# Altium schematic sheet Battery.SCHDOC
size A4
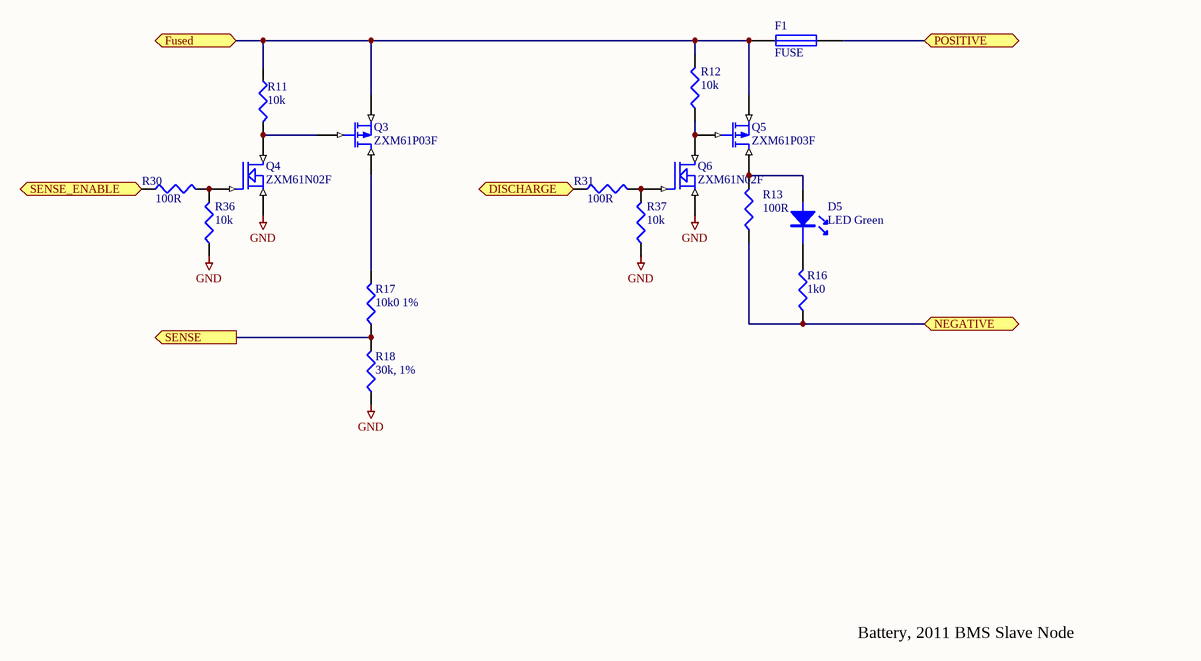
[diagram p0: Battery.SCHDOC]

## Parts
D5  LED Green  [0603_LED]
F1  FUSE  [LITTELFUSE-154]
Q3  ZXM61P03F  [SOT23-3]
Q4  ZXM61N02F  [SOT23-3]
Q5  ZXM61P03F  [SOT23-3]
Q6  ZXM61N02F  [SOT23-3]
R11  10k  [0603]
R12  10k  [0603]
R13  100R  [AXIAL-0.3]  (value not drawn)
R16  1k0  [0603]
R17  10k0 1%  [0603]
R18  30k, 1%  [0603]
R30  100R  [0603]
R31  100R  [0603]
R36  10k  [0603]
R37  10k  [0603]

## Ports
DISCHARGE (in), Fused, NEGATIVE (bidir), POSITIVE (bidir), SENSE (out), SENSE_ENABLE (in)

## Nets
GND: Q4.2(S) Q6.2(S) R18.1 R36.1 R37.1
DISCHARGE: R31.1 ; port DISCHARGE
Fused: F1.1 Q3.2(D) Q5.2(D) R11.1 R12.2 ; port Fused
NEGATIVE: R13.1 R16.1 ; port NEGATIVE
POSITIVE: F1.2 ; port POSITIVE
SENSE: R17.1 R18.2 ; port SENSE
SENSE_ENABLE: R30.1 ; port SENSE_ENABLE
NetD5_A: D5.A Q5.3(S) R13.2
NetD5_K: D5.K R16.2
NetQ3_1: Q3.1(G) Q4.3(D) R11.2
NetQ3_3: Q3.3(S) R17.2
NetQ4_1: Q4.1(G) R30.2 R36.2
NetQ5_1: Q5.1(G) Q6.3(D) R12.1
NetQ6_1: Q6.1(G) R31.2 R37.2

## Notes on the sheet
- Battery, 2011 BMS Slave Node

## Library data of the parts
D5 = LED: HSMG-C170, Green LED; Order#: 5790852; Price: 0.462; Supplier: Farnell
F1 = FUSE: Order#: 9943625; Supplier: Farnell; Price: 5.25
Q3 Q5 = ZXM61P03F: 1.1A, 30V P-Channel Enhancement mode FET; Order#: 9525300; Price: 0.825; Supplier: Farnell
Q4 Q6 = ZXM61N02F: 1.7A, 20V N-Channel Enhancement mode FET; Order#: 9525270; Price: 0.803; Supplier: Farnell
R11 R12 R18 = RES1: Resistor; Order#: 9330399; Price: 0.066; Supplier: Farnell
R13 = RES1: Resistor, 100R, 1W, 10V; Order#: 1107496; Price: 2.45; Supplier: Farnell
R16 = RES1: Resistor; Order#: 9330380; Price: 0.066; Supplier: Farnell
R17 = RES1: Resistor; Order#: 9330771; Price: 0.066; Supplier: Farnell
R30 R31 R36 R37 = RES1: Resistor; Order#: 9233253; Price: 0.088; Supplier: Farnell